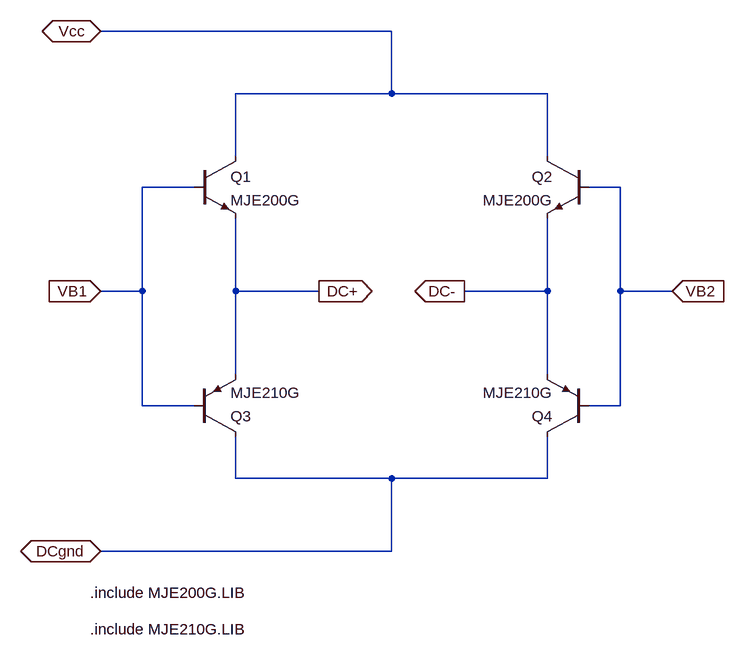
[diagram p0: schematic DC_Motor_Driver.asc]
DC_Motor_Driver.asc, the LTspice schematic file:
Version 4
SHEET 1 1272 872
WIRE 128 -336 -320 -336
WIRE 128 -240 128 -336
WIRE 128 -240 -112 -240
WIRE 368 -240 128 -240
WIRE -112 -144 -112 -240
WIRE 368 -144 368 -240
WIRE -176 -96 -256 -96
WIRE 480 -96 432 -96
WIRE -256 64 -256 -96
WIRE -256 64 -320 64
WIRE -112 64 -112 -48
WIRE 16 64 -112 64
WIRE 368 64 368 -48
WIRE 368 64 240 64
WIRE 480 64 480 -96
WIRE 560 64 480 64
WIRE -112 192 -112 64
WIRE 368 192 368 64
WIRE -256 240 -256 64
WIRE -176 240 -256 240
WIRE 480 240 480 64
WIRE 480 240 432 240
WIRE -112 352 -112 288
WIRE 128 352 -112 352
WIRE 368 352 368 288
WIRE 368 352 128 352
WIRE 128 464 128 352
WIRE 128 464 -320 464
FLAG -320 464 DCgnd
IOPIN -320 464 BiDir
FLAG -320 -336 Vcc
IOPIN -320 -336 BiDir
FLAG -320 64 VB1
IOPIN -320 64 In
FLAG 560 64 VB2
IOPIN 560 64 In
FLAG 16 64 DC+
IOPIN 16 64 Out
FLAG 240 64 DC-
IOPIN 240 64 Out
SYMBOL npn -176 -144 R0
SYMATTR InstName Q1
SYMATTR Value MJE200G
SYMBOL pnp -176 288 M180
SYMATTR InstName Q3
SYMATTR Value MJE210G
SYMBOL pnp 432 288 R180
SYMATTR InstName Q4
SYMATTR Value MJE210G
SYMBOL npn 432 -144 M0
SYMATTR InstName Q2
SYMATTR Value MJE200G
TEXT -336 528 Left 2 !.include MJE200G.LIB
TEXT -336 584 Left 2 !.include MJE210G.LIB

The netlist it stands for:
* DC_Motor_Driver.asc
Q1 Vcc VB1 DC+ 0 MJE200G
Q3 DCgnd VB1 DC+ 0 MJE210G
Q4 DCgnd VB2 DC- 0 MJE210G
Q2 Vcc VB2 DC- 0 MJE200G
.model NPN NPN
.model PNP PNP
.lib standard.bjt
.include MJE200G.LIB
.include MJE210G.LIB
.backanno
.end